# Altium schematic sheet CH3-Input.SchDoc: CH3 INPUT
size A4; Author: MOG; CompanyName: GIE GROUP; DrawnBy: MOG; Organization: Gie SA; Address1: Galicia 52; Address2: Mar del Plata; Address3: Buenos Aires; Address4: Argentina; DocumentNumber: 6; Revision: 0.0; SheetNumber: 7; SheetTotal: 14; Project: CP DATALOGGER; PageSetup: Record=PageOptions|CenterHorizontal=True|CenterVertical=True|PrintScale=0.94|XCorrection=1.00|YCorrection=1.00|PrintKind=0|BorderSize=5000000|LeftOffset=0|BottomOffset=0|Orientation=2|PaperLength=1000|PaperWidth=1000|Scale=100|PaperSource=7|PrintQuality=720|MediaType=1|DitherType=10|PaperKind=A4|PrintScaleMode=1
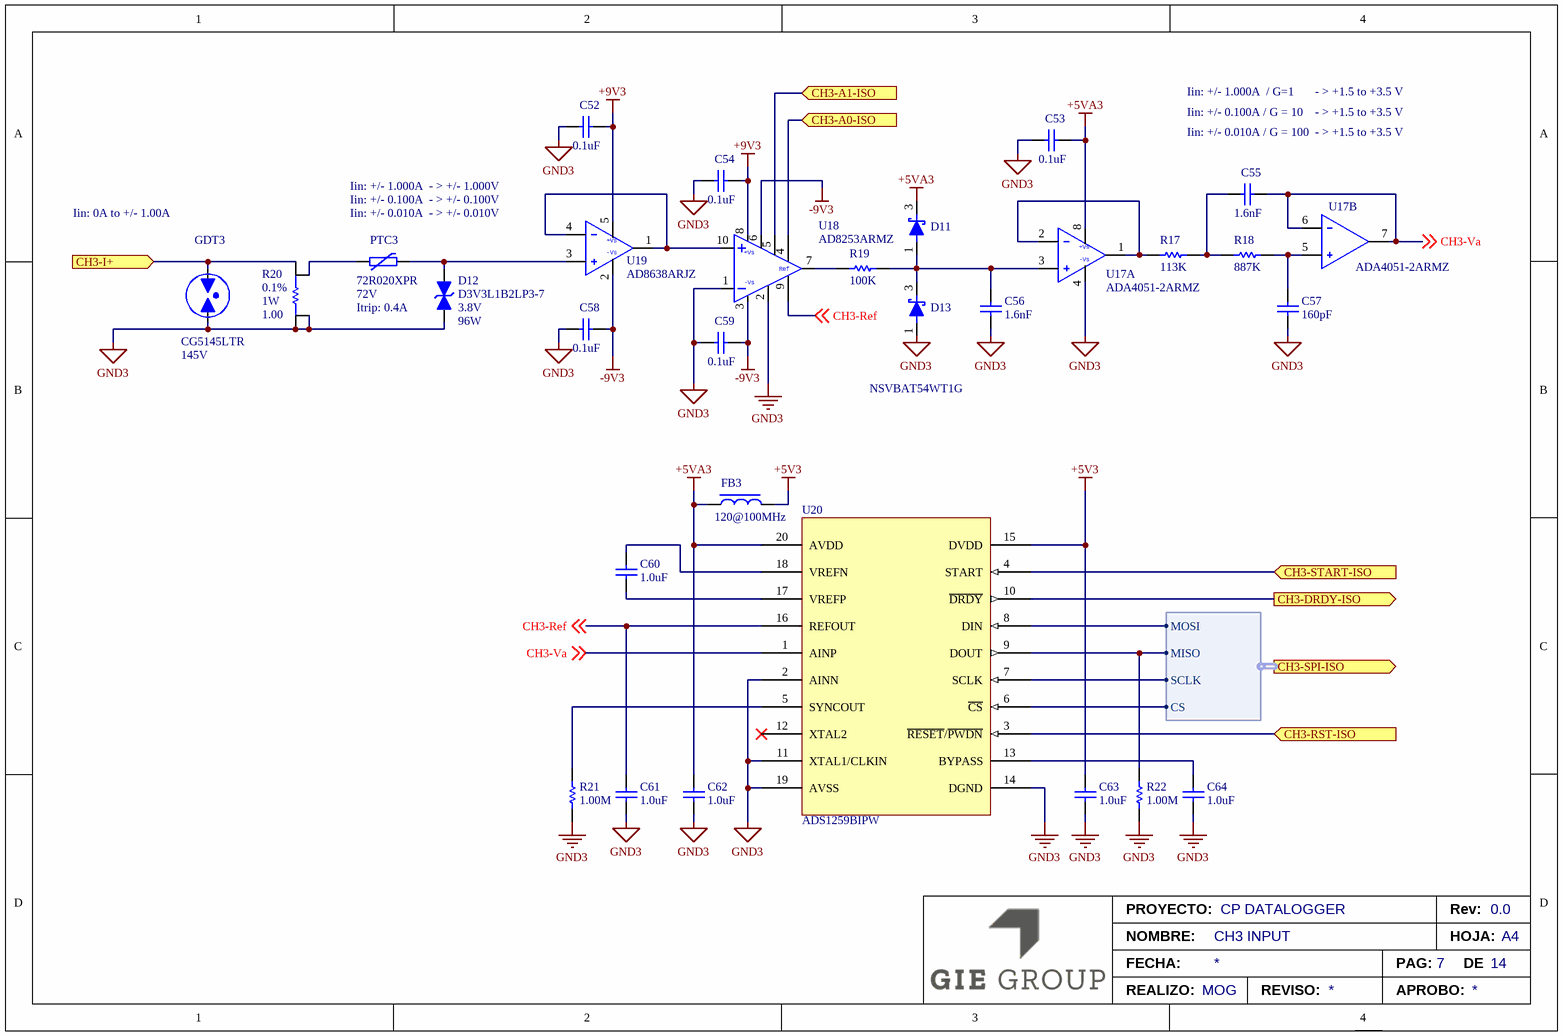
[diagram p0: CH3-Input.SchDoc]

## Parts
C52  value 0.1uF  [CAP-0603]  (hidden comment: C0603C104K5RACAUTO)
C53  value 0.1uF  [CAP-0603]  (hidden comment: C0603C104K5RACAUTO)
C54  value 0.1uF  [CAP-0603]  (hidden comment: C0603C104K5RACAUTO)
C55  value 1.6nF  [CAP-0603]  (hidden comment: C0603C162J5GAC7867)
C56  value 1.6nF  [CAP-0603]  (hidden comment: C0603C162J5GAC7867)
C57  value 160pF  [CAP-0603]  (hidden comment: C0603C161J1GAC7867)
C58  value 0.1uF  [CAP-0603]  (hidden comment: C0603C104K5RACAUTO)
C59  value 0.1uF  [CAP-0603]  (hidden comment: C0603C104K5RACAUTO)
C60  value 1.0uF  [CAP-0603]  (hidden comment: C0603C105M3RAC7867)
C61  value 1.0uF  [CAP-0603]  (hidden comment: C0603C105M3RAC7867)
C62  value 1.0uF  [CAP-0603]  (hidden comment: C0603C105M3RAC7867)
C63  value 1.0uF  [CAP-0603]  (hidden comment: C0603C105M3RAC7867)
C64  value 1.0uF  [CAP-0603]  (hidden comment: C0603C105M3RAC7867)
D11  NSVBAT54WT1G  [SOT-323-3]  (value not drawn)
D12  Voltage: 3.8V  Power: 96W  [DIODE-0603]  (hidden comment: D3V3L1B2LP3-7)
D13  NSVBAT54WT1G  [SOT-323-3]
FB3  value 120@100MHz  [IND-0603]  (hidden comment: Z0603C121GPWZT)
GDT3  Voltage: 145V  [LITTLELFUSE-CG5XXXLTR]  (hidden comment: CG5145LTR)
PTC3  Voltage: 72V  Itrip: 0.4A  [LITTLELFUSE-72R020X]  (hidden comment: 72R020XPR)
R17  value 113K  [RES-0603]  (hidden comment: RC0603FR-07113KL)
R18  value 887K  [RES-0603]  (hidden comment: RC0603FR-07887KL)
R19  value 100K  [RES-0603]  (hidden comment: RC0603FR-07100KL)
R20  value 1.00  Tolerance: 0.1%  Power: 1W  [RES-2512 WIDE]  (hidden comment: Y16061R00000B9W)
R21  value 1.00M  [RES-0603]  (hidden comment: RC0603FR-071ML)
R22  value 1.00M  [RES-0603]  (hidden comment: RC0603FR-071ML)
U17  ADA4051-2ARMZ  [MSOP8]  (parts A,B of 2)
U18  AD8253ARMZ  [MSOP10]
U19  AD8638ARJZ  [SOT23-5]
U20  ADS1259BIPW  [TSSOP20]

## Ports
CH3-A0-ISO (in), CH3-A1-ISO (in), CH3-DRDY-ISO (out), CH3-I+ (in), CH3-RST-ISO (in), CH3-SPI-ISO (out, harness CH3-SPI-ISO), CH3-START-ISO (in)

## Harnesses
CH3-SPI-ISO: MOSI, MISO, SCLK, CS

## Nets
+5V3: C63.2 FB3.2 U20.15(DVDD)
+5VA3: C53.2 C62.2 D11.3(K) FB3.1 U17.8(+VS) U20.20(AVDD)
+9V3: C52.2 C54.2 U18.8(+Vs) U19.5(+VS)
-9V3: C58.2 C59.2 U18.3(-Vs) U18.6(WR) U19.2(-Vs)
GND3: C52.1 C53.1 C54.1 C56.1 C57.1 C58.1 C59.1 C61.1 C62.1 C63.1 C64.1 D12.2(K) D13.1(A) GDT3.2(K) R20.E2 R20.I2 R21.1 R22.1 U17.4(-Vs) U18.1(-_IN) U18.2(DGND) U20.2(AINN) U20.11(XTAL1/CLKIN) U20.14(DGND) U20.19(AVSS)
CH3-A0-ISO: U18.4(A0) ; port CH3-A0-ISO
CH3-A1-ISO: U18.5(A1) ; port CH3-A1-ISO
CH3-DRDY-ISO: U20.10(~{DRDY}) ; port CH3-DRDY-ISO
CH3-I+: GDT3.1(A) R20.I1 ; port CH3-I+
CH3-Ref: C61.2 U18.9(REF) U20.16(REFOUT) ; off-sheet CH3-Ref
CH3-RST-ISO: U20.3(~{RESET}/~{PWDN}) ; port CH3-RST-ISO
CH3-START-ISO: U20.4(START) ; port CH3-START-ISO
CH3-Va: C55.1 U17.6(-INB) U17.7(OUTB) U20.1(AINP) ; off-sheet CH3-Va
NetC55_2: C55.2 R17.2 R18.1
NetC56_2: C56.2 D11.1(A) D13.3(K) R19.2 U17.3(+INA)
NetC57_2: C57.2 R18.2 U17.5(+INB)
NetC60_1: C60.1 U20.17(VREFP)
NetC60_2: C60.2 U20.18(VREFN)
NetC64_2: C64.2 U20.13(BYPASS)
NetD12_1: D12.1(A) PTC3.2 U19.3(+IN)
NetPTC3_1: PTC3.1 R20.E1
NetR17_1: R17.1 U17.1(OUTA) U17.2(-INA)
NetR19_1: R19.1 U18.7(OUT)
NetR21_2: R21.2 U20.5(SYNCOUT)
NetR22_2: R22.2 U20.9(DOUT) ; port CH3-SPI-ISO.MISO
NetU18_10: U18.10(+_IN) U19.1(OUT) U19.4(-IN)
NetU20_6: U20.6(~{CS}) ; port CH3-SPI-ISO.CS
NetU20_7: U20.7(SCLK) ; port CH3-SPI-ISO.SCLK
NetU20_8: U20.8(DIN) ; port CH3-SPI-ISO.MOSI

Not connected (* = marked no-connect by the designer): U20 12(XTAL2)*

## Notes on the sheet
- Iin: +/- 1.000A  / G=1       - > +1.5 to +3.5 V
- Iin: +/- 0.100A / G = 10    - > +1.5 to +3.5 V
- Iin: +/- 0.010A / G = 100  - > +1.5 to +3.5 V
- Iin: 0A to +/- 1.00A
- Iin: +/- 1.000A  - > +/- 1.000V
- Iin: +/- 0.100A  - > +/- 0.100V
- Iin: +/- 0.010A  - > +/- 0.010V
- PROYECTO:
- Rev:
- NOMBRE:
- FECHA:
- REALIZO:
- REVISO:
- APROBO:
- PAG:
- HOJA:
- DE
- A4
- (in symbol AD8253ARMZ) Ref
- (in symbol AD8638ARJZ) +Vs
- (in symbol ADA4051-2ARMZ, part A) +Vs

## Library data of the parts
C52-C54 C58 C59 = C0603C104K5RACAUTO: CAP CER 0.1uF 50V X7R 0603; Manufacturer: Kemet; Tolerance: 10%; Voltage: 50; PartNumber: C0603C104K5RACAUTO; Supplier 1: Digi-Key; Supplier 2: Mouser; Supplier Part Number 1: 399-6856-1-ND; Supplier Part Number 2: 80-C0603C104K5RAUTO
C55 C56 = C0603C162J5GAC7867: CAP CER 1600´pF 50V C0G 0603; Manufacturer: Kemet; Tolerance: 5%; Voltage: 50; PartNumber: C0603C162J5GAC7867; Supplier 1: Digi-Key; Supplier 2: Mouser; Supplier Part Number 1: 399-15368-1-ND; Supplier Part Number 2: 80-C0603C162J5G
C57 = C0603C161J1GAC7867: CAP CER 160 pF 100V C0G 0603; Manufacturer: Kemet; Tolerance: 5%; PartNumber: C0603C161J1GAC7867; Voltage: 100V; Supplier 1: Digi-Key; Supplier Part Number 1: 399-15367-1-ND
C60-C64 = C0603C105M3RAC7867: CAP CER 1uF 25V X7R 0603; Manufacturer: Kemet; Tolerance: 20%; Voltage: 25; PartNumber: C0603C105M3RAC7867; Supplier 1: Digi-Key; Supplier 2: Mouser; Supplier Part Number 1: 399-C0603C105M3RAC7867CT-ND; Supplier Part Number 2: 80-C0603C105M3R
D11 D13 = NSVBAT54WT1G: Schottky Diode 30V 200mA SOT323; Manufacturer: OnSemiconductor; IF(avg): 0.2A; VR(rms): 30V; Supplier 1: Digi-Key; Supplier 2: Mouser; Supplier Part Number 1: NSVBAT54WT1GOSDKR-ND; Supplier Part Number 2: 863-NSVBAT54WT1G; PartNumber: NSVBAT54WT1G
D12 = D3V3L1B2LP3-7: TVS Diode 1.5kW 130V 5% Bi-Directional; Manufacturer: Diodes Inc; PartNumber: D3V3L1B2LP3-7
FB3 = Z0603C121GPWZT: Ferrite Bead 120Ohms 900mA 25% DCR=130m; Manufacturer: Kemet; PartNumber: Z0603C121GPWZT; Supplier 1: Digi-Key; Supplier 2: Mouser; Supplier Part Number 1: 399-Z0603C121GPWZTCT-ND; Supplier Part Number 2: 80-Z0603C121GPWZT
GDT3 = CG5145LTR: Gas Discharge Tube 145V; Manufacturer: Littelfuse; Supplier 1: Digi-Key; Supplier 2: Mouser; Supplier Part Number 1: CG5145LTR-ND; Supplier Part Number 2: 576-CG5145LTR; PartNumber: CG5145LTR
PTC3 = 72R020XPR: PTC Polyfuse Radial 72V 0.2A; Manufacturer: Littlelfuse; Ihold: 0.2A; Supplier 1: Digi-Key; Supplier 2: Mouser; Supplier Part Number 1: 72R020XPRCT-ND; Supplier Part Number 2: 576-72R020XPR; PartNumber: 72R020XPR
R17 = RC0603FR-07113KL: RES SMD 113K OHM 1% 1/10W 0603; Manufacturer: Yageo; Power: 0.1W; Tolerance: 1%; PartNumber: RC0603FR-07113KL; Supplier 1: Digi-Key; Supplier 2: Mouser; Supplier Part Number 2: 603-RC0603FR-07113KL; Supplier Part Number 1: 311-113KHRCT-ND
R18 = RC0603FR-07887KL: RES SMD 887K OHM 1% 1/10W 0603; Manufacturer: Yageo; Power: 0.1W; Tolerance: 1%; PartNumber: RC0603FR-07887KL; Supplier 1: Digi-Key; Supplier 2: Mouser; Supplier Part Number 1: 311-887KHRCT-ND; Supplier Part Number 2: 603-RC0603FR-07887KL
R19 = RC0603FR-07100KL: RES SMD 100K OHM 1% 1/10W 0603; Manufacturer: Yageo; Power: 0.1W; Tolerance: 1%; PartNumber: RC0603FR-07100KL; Supplier 1: Digi-Key; Supplier 2: Mouser; Supplier Part Number 1: 311-100KHRCT-ND; Supplier Part Number 2: 603-RC0603FR-07100KL
R20 = Y16061R00000B9W: RES SMD 1 OHM 1W 2516 WIDE; Manufacturer: Vishay; PartNumber: Y16061R00000B9W
R21 R22 = RC0603FR-071ML: RES SMD 1M OHM 1% 1/10W 0603; Manufacturer: Yageo; Power: 0.1W; Tolerance: 1%; PartNumber: RC0603FR-071ML; Supplier 1: Digi-Key; Supplier 2: Mouser; Supplier Part Number 1: 311-887KHRCT-ND; Supplier Part Number 2: 603-RC0603FR-07887KL
U17 = ADA4051-2ARMZ: Dual  Precision Amplifier Micro Power Auto Zero; Manufacturer: Analog Devices; Supplier 1: Digi-Key; Supplier 2: Mouser; Supplier Part Number 1: 505-ADA4051-2ARMZ-ND; Supplier Part Number 2: 584-ADA4051-2ARMZ; PartNumber: ADA4051-2ARMZ
U18 = AD8253ARMZ: Instrumentation Amplifiers High Speed Programmable High Gain In-Amp; Manufacturer: Analog Devices Inc; PartNumber: AD8253ARMZ; Supplier 1: Digi-Key; Supplier 2: Mouser; Supplier Part Number 1: 505-AD8253ARMZ-R7DKR-ND; Supplier Part Number 2: 584-AD8253ARMZ-R7
U19 = AD8638ARJZ: 16V Auto-Zero CMOS Amplifier; Manufacturer: Analog Devices; Supplier 1: Digi-Key; Supplier 2: Mouser; Supplier Part Number 1: 505-AD8638ARJZ-REEL7DKR-ND; Supplier Part Number 2: 584-AD8638ARJZ-R7; PartNumber: AD8638ARJZ
U20 = ADS1259BIPW: Analog to Digital Converter 14.4kSPS 24-Bit; Manufacturer: Texas Instruments; Supplier 1: Digi-Key; Supplier 2: Mouser; Supplier Part Number 1: 296-27183-5-ND; Supplier Part Number 2: 595-ADS1259BIPW; PartNumber: ADS1259BIPW